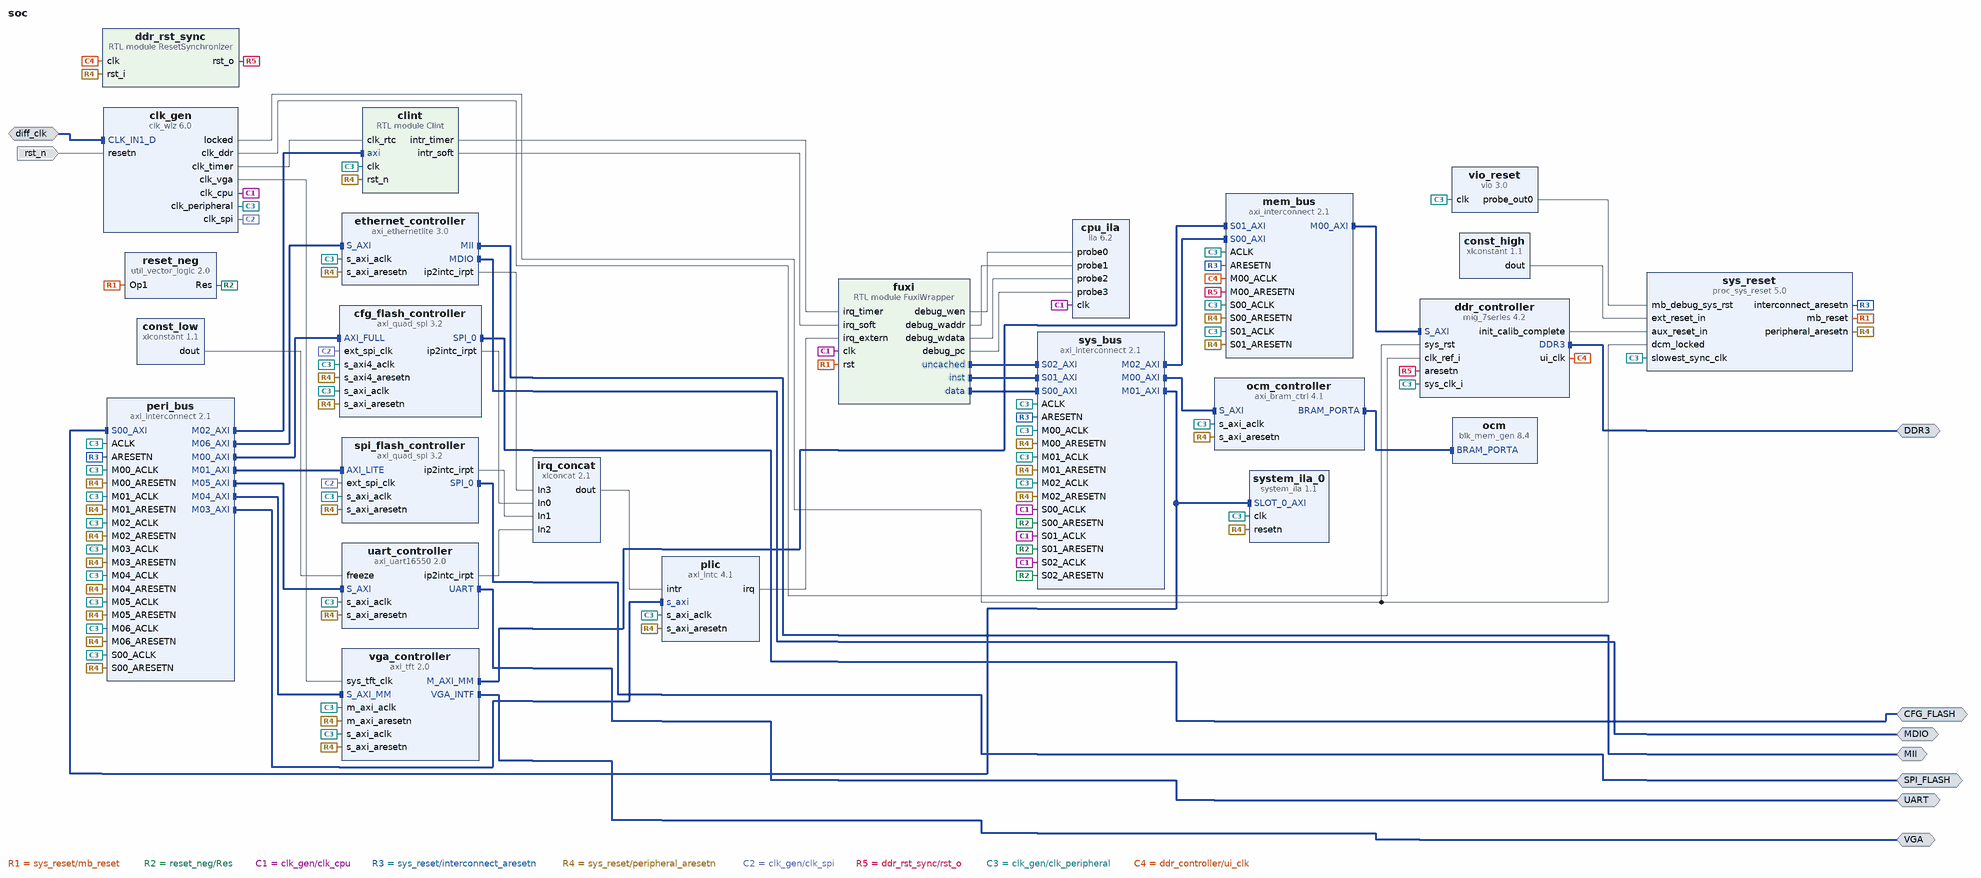
[diagram p0: block diagram of the top level]
# Vivado block design soc, xc7a100tfgg484-2, Vivado 2020.2
create_bd_design soc

create_bd_intf_port -mode Master -vlnv xilinx.com:interface:spi_rtl:1.0 CFG_FLASH
create_bd_intf_port -mode Master -vlnv xilinx.com:interface:spi_rtl:1.0 SPI_FLASH
create_bd_intf_port -mode Master -vlnv xilinx.com:interface:vga_rtl:1.0 VGA
create_bd_intf_port -mode Master -vlnv xilinx.com:interface:uart_rtl:1.0 UART
create_bd_intf_port -mode Master -vlnv xilinx.com:interface:mii_rtl:1.0 MII
create_bd_intf_port -mode Master -vlnv xilinx.com:interface:mdio_rtl:1.0 MDIO
create_bd_intf_port -mode Slave -vlnv xilinx.com:interface:diff_clock_rtl:1.0 diff_clk
set_property -dict {CONFIG.FREQ_HZ 200000000} [get_bd_intf_ports diff_clk]
create_bd_intf_port -mode Master -vlnv xilinx.com:interface:ddrx_rtl:1.0 DDR3
create_bd_port -dir I -type rst rst_n

create_bd_cell -type module -reference Clint clint
create_bd_cell -type module -reference FuxiWrapper fuxi
create_bd_cell -type ip -vlnv xilinx.com:ip:axi_bram_ctrl:4.1 ocm_controller
set_property -dict {CONFIG.SINGLE_PORT_BRAM 1} [get_bd_cells ocm_controller]
create_bd_cell -type ip -vlnv xilinx.com:ip:axi_ethernetlite:3.0 ethernet_controller
create_bd_cell -type ip -vlnv xilinx.com:ip:axi_intc:4.1 plic
set_property -dict {CONFIG.C_IRQ_CONNECTION 1} [get_bd_cells plic]
create_bd_cell -type ip -vlnv xilinx.com:ip:axi_interconnect:2.1 sys_bus
set_property -dict [list \
  CONFIG.ENABLE_ADVANCED_OPTIONS 1 \
  CONFIG.NUM_MI 3 \
  CONFIG.NUM_SI 3 \
  CONFIG.S00_HAS_DATA_FIFO 2 \
  CONFIG.S01_ARB_PRIORITY 1 \
  CONFIG.S01_HAS_DATA_FIFO 2 \
  CONFIG.S02_ARB_PRIORITY 2 \
  CONFIG.S02_HAS_DATA_FIFO 2 \
  CONFIG.STRATEGY 2 \
] [get_bd_cells sys_bus]
create_bd_cell -type ip -vlnv xilinx.com:ip:axi_interconnect:2.1 peri_bus
set_property -dict {CONFIG.NUM_MI 7 CONFIG.S00_HAS_DATA_FIFO 2 CONFIG.STRATEGY 2} [get_bd_cells peri_bus]
create_bd_cell -type ip -vlnv xilinx.com:ip:axi_interconnect:2.1 mem_bus
set_property -dict [list \
  CONFIG.NUM_MI 1 \
  CONFIG.NUM_SI 2 \
  CONFIG.S00_HAS_DATA_FIFO 2 \
  CONFIG.S01_HAS_DATA_FIFO 2 \
  CONFIG.STRATEGY 2 \
] [get_bd_cells mem_bus]
create_bd_cell -type ip -vlnv xilinx.com:ip:axi_quad_spi:3.2 cfg_flash_controller
set_property -dict [list \
  CONFIG.C_SPI_MEMORY 2 \
  CONFIG.C_SPI_MEM_ADDR_BITS 32 \
  CONFIG.C_SPI_MODE 2 \
  CONFIG.C_S_AXI4_ID_WIDTH 0 \
  CONFIG.C_TYPE_OF_AXI4_INTERFACE 1 \
  CONFIG.C_USE_STARTUP 0 \
  CONFIG.C_XIP_MODE 1 \
] [get_bd_cells cfg_flash_controller]
create_bd_cell -type ip -vlnv xilinx.com:ip:axi_quad_spi:3.2 spi_flash_controller
set_property -dict [list \
  CONFIG.C_FIFO_DEPTH 256 \
  CONFIG.C_SPI_MEMORY 2 \
  CONFIG.C_SPI_MODE 2 \
  CONFIG.C_S_AXI4_ID_WIDTH 0 \
  CONFIG.C_USE_STARTUP 0 \
] [get_bd_cells spi_flash_controller]
create_bd_cell -type ip -vlnv xilinx.com:ip:axi_tft:2.0 vga_controller
set_property -dict [list \
  CONFIG.C_EN_I2C_INTF 0 \
  CONFIG.C_MAX_BURST_LEN 128 \
  CONFIG.C_M_AXI_DATA_WIDTH 64 \
  CONFIG.C_TFT_INTERFACE 0 \
] [get_bd_cells vga_controller]
create_bd_cell -type ip -vlnv xilinx.com:ip:axi_uart16550:2.0 uart_controller
create_bd_cell -type ip -vlnv xilinx.com:ip:blk_mem_gen:8.4 ocm
set_property -dict [list \
  CONFIG.Coe_File ../../../../new/ocm.coe \
  CONFIG.EN_SAFETY_CKT false \
  CONFIG.Enable_32bit_Address true \
  CONFIG.Fill_Remaining_Memory_Locations false \
  CONFIG.Load_Init_File true \
  CONFIG.Register_PortA_Output_of_Memory_Primitives false \
  CONFIG.Use_RSTA_Pin true \
  CONFIG.Write_Depth_A 16384 \
  CONFIG.use_bram_block Stand_Alone \
] [get_bd_cells ocm]
create_bd_cell -type ip -vlnv xilinx.com:ip:clk_wiz:6.0 clk_gen
set_property -dict [list \
  CONFIG.CLKIN1_JITTER_PS 50.0 \
  CONFIG.CLKIN2_JITTER_PS 66.66000000000001 \
  CONFIG.CLKOUT1_JITTER 129.198 \
  CONFIG.CLKOUT1_PHASE_ERROR 89.971 \
  CONFIG.CLKOUT1_REQUESTED_OUT_FREQ 50 \
  CONFIG.CLKOUT2_JITTER 98.146 \
  CONFIG.CLKOUT2_PHASE_ERROR 89.971 \
  CONFIG.CLKOUT2_REQUESTED_OUT_FREQ 200 \
  CONFIG.CLKOUT2_USED true \
  CONFIG.CLKOUT3_JITTER 148.629 \
  CONFIG.CLKOUT3_PHASE_ERROR 89.971 \
  CONFIG.CLKOUT3_REQUESTED_OUT_FREQ 25 \
  CONFIG.CLKOUT3_USED true \
  CONFIG.CLKOUT4_JITTER 155.330 \
  CONFIG.CLKOUT4_PHASE_ERROR 89.971 \
  CONFIG.CLKOUT4_REQUESTED_OUT_FREQ 20 \
  CONFIG.CLKOUT4_USED true \
  CONFIG.CLKOUT5_JITTER 112.316 \
  CONFIG.CLKOUT5_PHASE_ERROR 89.971 \
  CONFIG.CLKOUT5_REQUESTED_OUT_FREQ 100 \
  CONFIG.CLKOUT5_USED true \
  CONFIG.CLKOUT6_JITTER 112.316 \
  CONFIG.CLKOUT6_PHASE_ERROR 89.971 \
  CONFIG.CLKOUT6_REQUESTED_OUT_FREQ 100 \
  CONFIG.CLKOUT6_USED true \
  CONFIG.CLK_OUT1_PORT clk_cpu \
  CONFIG.CLK_OUT2_PORT clk_ddr \
  CONFIG.CLK_OUT3_PORT clk_vga \
  CONFIG.CLK_OUT4_PORT clk_spi \
  CONFIG.CLK_OUT5_PORT clk_peripheral \
  CONFIG.CLK_OUT6_PORT clk_timer \
  CONFIG.MMCM_CLKFBOUT_MULT_F 5.000 \
  CONFIG.MMCM_CLKIN1_PERIOD 5.000 \
  CONFIG.MMCM_CLKIN2_PERIOD 6.667 \
  CONFIG.MMCM_CLKOUT0_DIVIDE_F 20.000 \
  CONFIG.MMCM_CLKOUT1_DIVIDE 5 \
  CONFIG.MMCM_CLKOUT2_DIVIDE 40 \
  CONFIG.MMCM_CLKOUT3_DIVIDE 50 \
  CONFIG.MMCM_CLKOUT4_DIVIDE 10 \
  CONFIG.MMCM_CLKOUT5_DIVIDE 10 \
  CONFIG.MMCM_DIVCLK_DIVIDE 1 \
  CONFIG.NUM_OUT_CLKS 6 \
  CONFIG.PRIM_SOURCE Differential_clock_capable_pin \
  CONFIG.RESET_PORT resetn \
  CONFIG.RESET_TYPE ACTIVE_LOW \
  CONFIG.SECONDARY_IN_FREQ 150.001 \
  CONFIG.SECONDARY_SOURCE Differential_clock_capable_pin \
  CONFIG.USE_INCLK_SWITCHOVER false \
] [get_bd_cells clk_gen]
create_bd_cell -type ip -vlnv xilinx.com:ip:ila:6.2 cpu_ila
set_property -dict [list \
  CONFIG.C_ENABLE_ILA_AXI_MON false \
  CONFIG.C_MONITOR_TYPE Native \
  CONFIG.C_NUM_OF_PROBES 4 \
  CONFIG.C_PROBE1_WIDTH 5 \
  CONFIG.C_PROBE2_WIDTH 32 \
  CONFIG.C_PROBE3_WIDTH 32 \
] [get_bd_cells cpu_ila]
create_bd_cell -type ip -vlnv xilinx.com:ip:util_vector_logic:2.0 reset_neg
set_property -dict {CONFIG.C_OPERATION not CONFIG.C_SIZE 1} [get_bd_cells reset_neg]
create_bd_cell -type ip -vlnv xilinx.com:ip:xlconcat:2.1 irq_concat
set_property -dict {CONFIG.NUM_PORTS 4 CONFIG.dout_width 4} [get_bd_cells irq_concat]
create_bd_cell -type ip -vlnv xilinx.com:ip:xlconstant:1.1 const_low
set_property -dict {CONFIG.CONST_VAL 0} [get_bd_cells const_low]
create_bd_cell -type ip -vlnv xilinx.com:ip:xlconstant:1.1 const_high
create_bd_cell -type module -reference ResetSynchronizer ddr_rst_sync
create_bd_cell -type ip -vlnv xilinx.com:ip:proc_sys_reset:5.0 sys_reset
set_property -dict {CONFIG.C_AUX_RESET_HIGH 0} [get_bd_cells sys_reset]
create_bd_cell -type ip -vlnv xilinx.com:ip:vio:3.0 vio_reset
set_property -dict {CONFIG.C_NUM_PROBE_IN 0} [get_bd_cells vio_reset]
create_bd_cell -type ip -vlnv xilinx.com:ip:system_ila:1.1 system_ila_0
create_bd_cell -type ip -vlnv xilinx.com:ip:mig_7series:4.2 ddr_controller
set_property -dict [list \
  CONFIG.BOARD_MIG_PARAM Custom \
  CONFIG.RESET_BOARD_INTERFACE Custom \
  CONFIG.XML_INPUT_FILE mig_a.prj \
] [get_bd_cells ddr_controller]

# ---- connections ----

connect_bd_intf_net [get_bd_intf_pins mem_bus/M00_AXI] [get_bd_intf_pins ddr_controller/S_AXI]
connect_bd_intf_net [get_bd_intf_ports MII] [get_bd_intf_pins ethernet_controller/MII]
connect_bd_intf_net [get_bd_intf_pins peri_bus/M05_AXI] [get_bd_intf_pins uart_controller/S_AXI]
connect_bd_intf_net [get_bd_intf_pins peri_bus/M03_AXI] [get_bd_intf_pins plic/s_axi]
connect_bd_intf_net [get_bd_intf_pins peri_bus/M06_AXI] [get_bd_intf_pins ethernet_controller/S_AXI]
connect_bd_intf_net [get_bd_intf_ports SPI_FLASH] [get_bd_intf_pins spi_flash_controller/SPI_0]
connect_bd_intf_net [get_bd_intf_pins mem_bus/S00_AXI] [get_bd_intf_pins sys_bus/M02_AXI]
connect_bd_intf_net -intf_net CLK_IN1_D_0_1 [get_bd_intf_ports diff_clk] [get_bd_intf_pins clk_gen/CLK_IN1_D]
connect_bd_intf_net [get_bd_intf_pins peri_bus/M04_AXI] [get_bd_intf_pins vga_controller/S_AXI_MM]
connect_bd_intf_net [get_bd_intf_ports MDIO] [get_bd_intf_pins ethernet_controller/MDIO]
connect_bd_intf_net [get_bd_intf_pins fuxi/uncached] [get_bd_intf_pins sys_bus/S02_AXI]
connect_bd_intf_net -intf_net axi_interconnect_0_M00_AXI [get_bd_intf_pins sys_bus/M00_AXI] [get_bd_intf_pins ocm_controller/S_AXI]
connect_bd_intf_net [get_bd_intf_ports CFG_FLASH] [get_bd_intf_pins cfg_flash_controller/SPI_0]
connect_bd_intf_net [get_bd_intf_ports UART] [get_bd_intf_pins uart_controller/UART]
connect_bd_intf_net [get_bd_intf_pins vga_controller/M_AXI_MM] [get_bd_intf_pins mem_bus/S01_AXI]
connect_bd_intf_net [get_bd_intf_pins peri_bus/M00_AXI] [get_bd_intf_pins cfg_flash_controller/AXI_FULL]
connect_bd_intf_net [get_bd_intf_pins fuxi/inst] [get_bd_intf_pins sys_bus/S01_AXI]
connect_bd_intf_net [get_bd_intf_ports VGA] [get_bd_intf_pins vga_controller/VGA_INTF]
connect_bd_intf_net [get_bd_intf_pins peri_bus/M01_AXI] [get_bd_intf_pins spi_flash_controller/AXI_LITE]
connect_bd_intf_net [get_bd_intf_pins ocm_controller/BRAM_PORTA] [get_bd_intf_pins ocm/BRAM_PORTA]
connect_bd_intf_net [get_bd_intf_pins peri_bus/M02_AXI] [get_bd_intf_pins clint/axi]
connect_bd_intf_net [get_bd_intf_pins sys_bus/M01_AXI] [get_bd_intf_pins peri_bus/S00_AXI]
connect_bd_intf_net [get_bd_intf_pins sys_bus/M01_AXI] [get_bd_intf_pins system_ila_0/SLOT_0_AXI]
connect_bd_intf_net [get_bd_intf_pins fuxi/data] [get_bd_intf_pins sys_bus/S00_AXI]
connect_bd_intf_net [get_bd_intf_ports DDR3] [get_bd_intf_pins ddr_controller/DDR3]
connect_bd_net -net resetn_0_1 [get_bd_ports rst_n] [get_bd_pins clk_gen/resetn]
connect_bd_net [get_bd_pins vio_reset/probe_out0] [get_bd_pins sys_reset/mb_debug_sys_rst]
connect_bd_net [get_bd_pins clk_gen/locked] [get_bd_pins sys_reset/dcm_locked] [get_bd_pins ddr_controller/sys_rst]
connect_bd_net -net const_zero_dout [get_bd_pins const_low/dout] [get_bd_pins uart_controller/freeze]
connect_bd_net [get_bd_pins sys_reset/mb_reset] [get_bd_pins fuxi/rst] [get_bd_pins reset_neg/Op1]
connect_bd_net [get_bd_pins reset_neg/Res] [get_bd_pins sys_bus/S00_ARESETN] [get_bd_pins sys_bus/S01_ARESETN] [get_bd_pins sys_bus/S02_ARESETN]
connect_bd_net [get_bd_pins clk_gen/clk_cpu] \
  [get_bd_pins fuxi/clk] [get_bd_pins sys_bus/S00_ACLK] [get_bd_pins sys_bus/S01_ACLK] [get_bd_pins sys_bus/S02_ACLK] \
  [get_bd_pins cpu_ila/clk]
connect_bd_net [get_bd_pins sys_reset/interconnect_aresetn] [get_bd_pins sys_bus/ARESETN] [get_bd_pins peri_bus/ARESETN] [get_bd_pins mem_bus/ARESETN]
connect_bd_net [get_bd_pins sys_reset/peripheral_aresetn] \
  [get_bd_pins clint/rst_n] [get_bd_pins ocm_controller/s_axi_aresetn] [get_bd_pins ethernet_controller/s_axi_aresetn] \
  [get_bd_pins plic/s_axi_aresetn] [get_bd_pins sys_bus/M00_ARESETN] [get_bd_pins sys_bus/M01_ARESETN] \
  [get_bd_pins sys_bus/M02_ARESETN] [get_bd_pins peri_bus/S00_ARESETN] [get_bd_pins peri_bus/M00_ARESETN] \
  [get_bd_pins peri_bus/M01_ARESETN] [get_bd_pins peri_bus/M02_ARESETN] [get_bd_pins peri_bus/M03_ARESETN] \
  [get_bd_pins peri_bus/M04_ARESETN] [get_bd_pins peri_bus/M05_ARESETN] [get_bd_pins peri_bus/M06_ARESETN] \
  [get_bd_pins mem_bus/S00_ARESETN] [get_bd_pins mem_bus/S01_ARESETN] [get_bd_pins cfg_flash_controller/s_axi_aresetn] \
  [get_bd_pins cfg_flash_controller/s_axi4_aresetn] [get_bd_pins spi_flash_controller/s_axi_aresetn] \
  [get_bd_pins vga_controller/s_axi_aresetn] [get_bd_pins vga_controller/m_axi_aresetn] \
  [get_bd_pins uart_controller/s_axi_aresetn] [get_bd_pins ddr_rst_sync/rst_i] [get_bd_pins system_ila_0/resetn]
connect_bd_net [get_bd_pins clk_gen/clk_spi] [get_bd_pins cfg_flash_controller/ext_spi_clk] [get_bd_pins spi_flash_controller/ext_spi_clk]
connect_bd_net [get_bd_pins clk_gen/clk_timer] [get_bd_pins clint/clk_rtc]
connect_bd_net [get_bd_pins clint/intr_timer] [get_bd_pins fuxi/irq_timer]
connect_bd_net [get_bd_pins clint/intr_soft] [get_bd_pins fuxi/irq_soft]
connect_bd_net [get_bd_pins plic/irq] [get_bd_pins fuxi/irq_extern]
connect_bd_net -net xlconcat_0_dout [get_bd_pins irq_concat/dout] [get_bd_pins plic/intr]
connect_bd_net [get_bd_pins cfg_flash_controller/ip2intc_irpt] [get_bd_pins irq_concat/In0]
connect_bd_net [get_bd_pins spi_flash_controller/ip2intc_irpt] [get_bd_pins irq_concat/In1]
connect_bd_net [get_bd_pins clk_gen/clk_vga] [get_bd_pins vga_controller/sys_tft_clk]
connect_bd_net [get_bd_pins uart_controller/ip2intc_irpt] [get_bd_pins irq_concat/In2]
connect_bd_net [get_bd_pins ethernet_controller/ip2intc_irpt] [get_bd_pins irq_concat/In3]
connect_bd_net [get_bd_pins fuxi/debug_wen] [get_bd_pins cpu_ila/probe0]
connect_bd_net [get_bd_pins fuxi/debug_waddr] [get_bd_pins cpu_ila/probe1]
connect_bd_net [get_bd_pins fuxi/debug_wdata] [get_bd_pins cpu_ila/probe2]
connect_bd_net [get_bd_pins fuxi/debug_pc] [get_bd_pins cpu_ila/probe3]
connect_bd_net [get_bd_pins ddr_rst_sync/rst_o] [get_bd_pins mem_bus/M00_ARESETN] [get_bd_pins ddr_controller/aresetn]
connect_bd_net [get_bd_pins const_high/dout] [get_bd_pins sys_reset/ext_reset_in]
connect_bd_net [get_bd_pins clk_gen/clk_ddr] [get_bd_pins ddr_controller/clk_ref_i]
connect_bd_net [get_bd_pins clk_gen/clk_peripheral] \
  [get_bd_pins vio_reset/clk] [get_bd_pins sys_reset/slowest_sync_clk] [get_bd_pins sys_bus/ACLK] \
  [get_bd_pins sys_bus/M00_ACLK] [get_bd_pins sys_bus/M02_ACLK] [get_bd_pins sys_bus/M01_ACLK] [get_bd_pins peri_bus/ACLK] \
  [get_bd_pins peri_bus/S00_ACLK] [get_bd_pins peri_bus/M00_ACLK] [get_bd_pins peri_bus/M01_ACLK] \
  [get_bd_pins peri_bus/M02_ACLK] [get_bd_pins peri_bus/M03_ACLK] [get_bd_pins peri_bus/M04_ACLK] \
  [get_bd_pins peri_bus/M05_ACLK] [get_bd_pins peri_bus/M06_ACLK] [get_bd_pins system_ila_0/clk] \
  [get_bd_pins uart_controller/s_axi_aclk] [get_bd_pins spi_flash_controller/s_axi_aclk] \
  [get_bd_pins cfg_flash_controller/s_axi4_aclk] [get_bd_pins cfg_flash_controller/s_axi_aclk] \
  [get_bd_pins ethernet_controller/s_axi_aclk] [get_bd_pins plic/s_axi_aclk] [get_bd_pins vga_controller/s_axi_aclk] \
  [get_bd_pins vga_controller/m_axi_aclk] [get_bd_pins clint/clk] [get_bd_pins ocm_controller/s_axi_aclk] \
  [get_bd_pins mem_bus/S00_ACLK] [get_bd_pins mem_bus/ACLK] [get_bd_pins mem_bus/S01_ACLK] \
  [get_bd_pins ddr_controller/sys_clk_i]
connect_bd_net [get_bd_pins ddr_controller/ui_clk] [get_bd_pins mem_bus/M00_ACLK] [get_bd_pins ddr_rst_sync/clk]
connect_bd_net [get_bd_pins ddr_controller/init_calib_complete] [get_bd_pins sys_reset/aux_reset_in]

# ---- address map ----
assign_bd_address -offset 0x00000000 -range 64K -target_address_space [get_bd_addr_spaces fuxi/data] [get_bd_addr_segs ocm_controller/S_AXI/Mem0]
assign_bd_address -offset 0x10000000 -range 16M -target_address_space [get_bd_addr_spaces fuxi/data] [get_bd_addr_segs cfg_flash_controller/aximm/MEM0]
assign_bd_address -offset 0x11000000 -range 4K -target_address_space [get_bd_addr_spaces fuxi/data] [get_bd_addr_segs clint/axi/reg0]
assign_bd_address -offset 0x11010000 -range 64K -target_address_space [get_bd_addr_spaces fuxi/data] [get_bd_addr_segs plic/S_AXI/Reg]
assign_bd_address -offset 0x11020000 -range 4K -target_address_space [get_bd_addr_spaces fuxi/data] [get_bd_addr_segs spi_flash_controller/AXI_LITE/Reg]
assign_bd_address -offset 0x11030000 -range 64K -target_address_space [get_bd_addr_spaces fuxi/data] [get_bd_addr_segs vga_controller/S_AXI_MM/Reg]
assign_bd_address -offset 0x11040000 -range 8K -target_address_space [get_bd_addr_spaces fuxi/data] [get_bd_addr_segs uart_controller/S_AXI/Reg]
assign_bd_address -offset 0x11060000 -range 64K -target_address_space [get_bd_addr_spaces fuxi/data] [get_bd_addr_segs ethernet_controller/S_AXI/Reg]
assign_bd_address -offset 0x00000000 -range 64K -target_address_space [get_bd_addr_spaces fuxi/inst] [get_bd_addr_segs ocm_controller/S_AXI/Mem0]
assign_bd_address -offset 0x10000000 -range 16M -target_address_space [get_bd_addr_spaces fuxi/inst] [get_bd_addr_segs cfg_flash_controller/aximm/MEM0]
assign_bd_address -offset 0x11000000 -range 4K -target_address_space [get_bd_addr_spaces fuxi/inst] [get_bd_addr_segs clint/axi/reg0]
assign_bd_address -offset 0x11010000 -range 64K -target_address_space [get_bd_addr_spaces fuxi/inst] [get_bd_addr_segs plic/S_AXI/Reg]
assign_bd_address -offset 0x11020000 -range 4K -target_address_space [get_bd_addr_spaces fuxi/inst] [get_bd_addr_segs spi_flash_controller/AXI_LITE/Reg]
assign_bd_address -offset 0x11030000 -range 64K -target_address_space [get_bd_addr_spaces fuxi/inst] [get_bd_addr_segs vga_controller/S_AXI_MM/Reg]
assign_bd_address -offset 0x11040000 -range 8K -target_address_space [get_bd_addr_spaces fuxi/inst] [get_bd_addr_segs uart_controller/S_AXI/Reg]
assign_bd_address -offset 0x11060000 -range 64K -target_address_space [get_bd_addr_spaces fuxi/inst] [get_bd_addr_segs ethernet_controller/S_AXI/Reg]
assign_bd_address -offset 0x00000000 -range 64K -target_address_space [get_bd_addr_spaces fuxi/uncached] [get_bd_addr_segs ocm_controller/S_AXI/Mem0]
assign_bd_address -offset 0x10000000 -range 16M -target_address_space [get_bd_addr_spaces fuxi/uncached] [get_bd_addr_segs cfg_flash_controller/aximm/MEM0]
assign_bd_address -offset 0x11000000 -range 4K -target_address_space [get_bd_addr_spaces fuxi/uncached] [get_bd_addr_segs clint/axi/reg0]
assign_bd_address -offset 0x11010000 -range 64K -target_address_space [get_bd_addr_spaces fuxi/uncached] [get_bd_addr_segs plic/S_AXI/Reg]
assign_bd_address -offset 0x11020000 -range 4K -target_address_space [get_bd_addr_spaces fuxi/uncached] [get_bd_addr_segs spi_flash_controller/AXI_LITE/Reg]
assign_bd_address -offset 0x11030000 -range 64K -target_address_space [get_bd_addr_spaces fuxi/uncached] [get_bd_addr_segs vga_controller/S_AXI_MM/Reg]
assign_bd_address -offset 0x11040000 -range 8K -target_address_space [get_bd_addr_spaces fuxi/uncached] [get_bd_addr_segs uart_controller/S_AXI/Reg]
assign_bd_address -offset 0x11060000 -range 64K -target_address_space [get_bd_addr_spaces fuxi/uncached] [get_bd_addr_segs ethernet_controller/S_AXI/Reg]

validate_bd_design
save_bd_design
